# Altium project Battery_monitor.PrjPcb
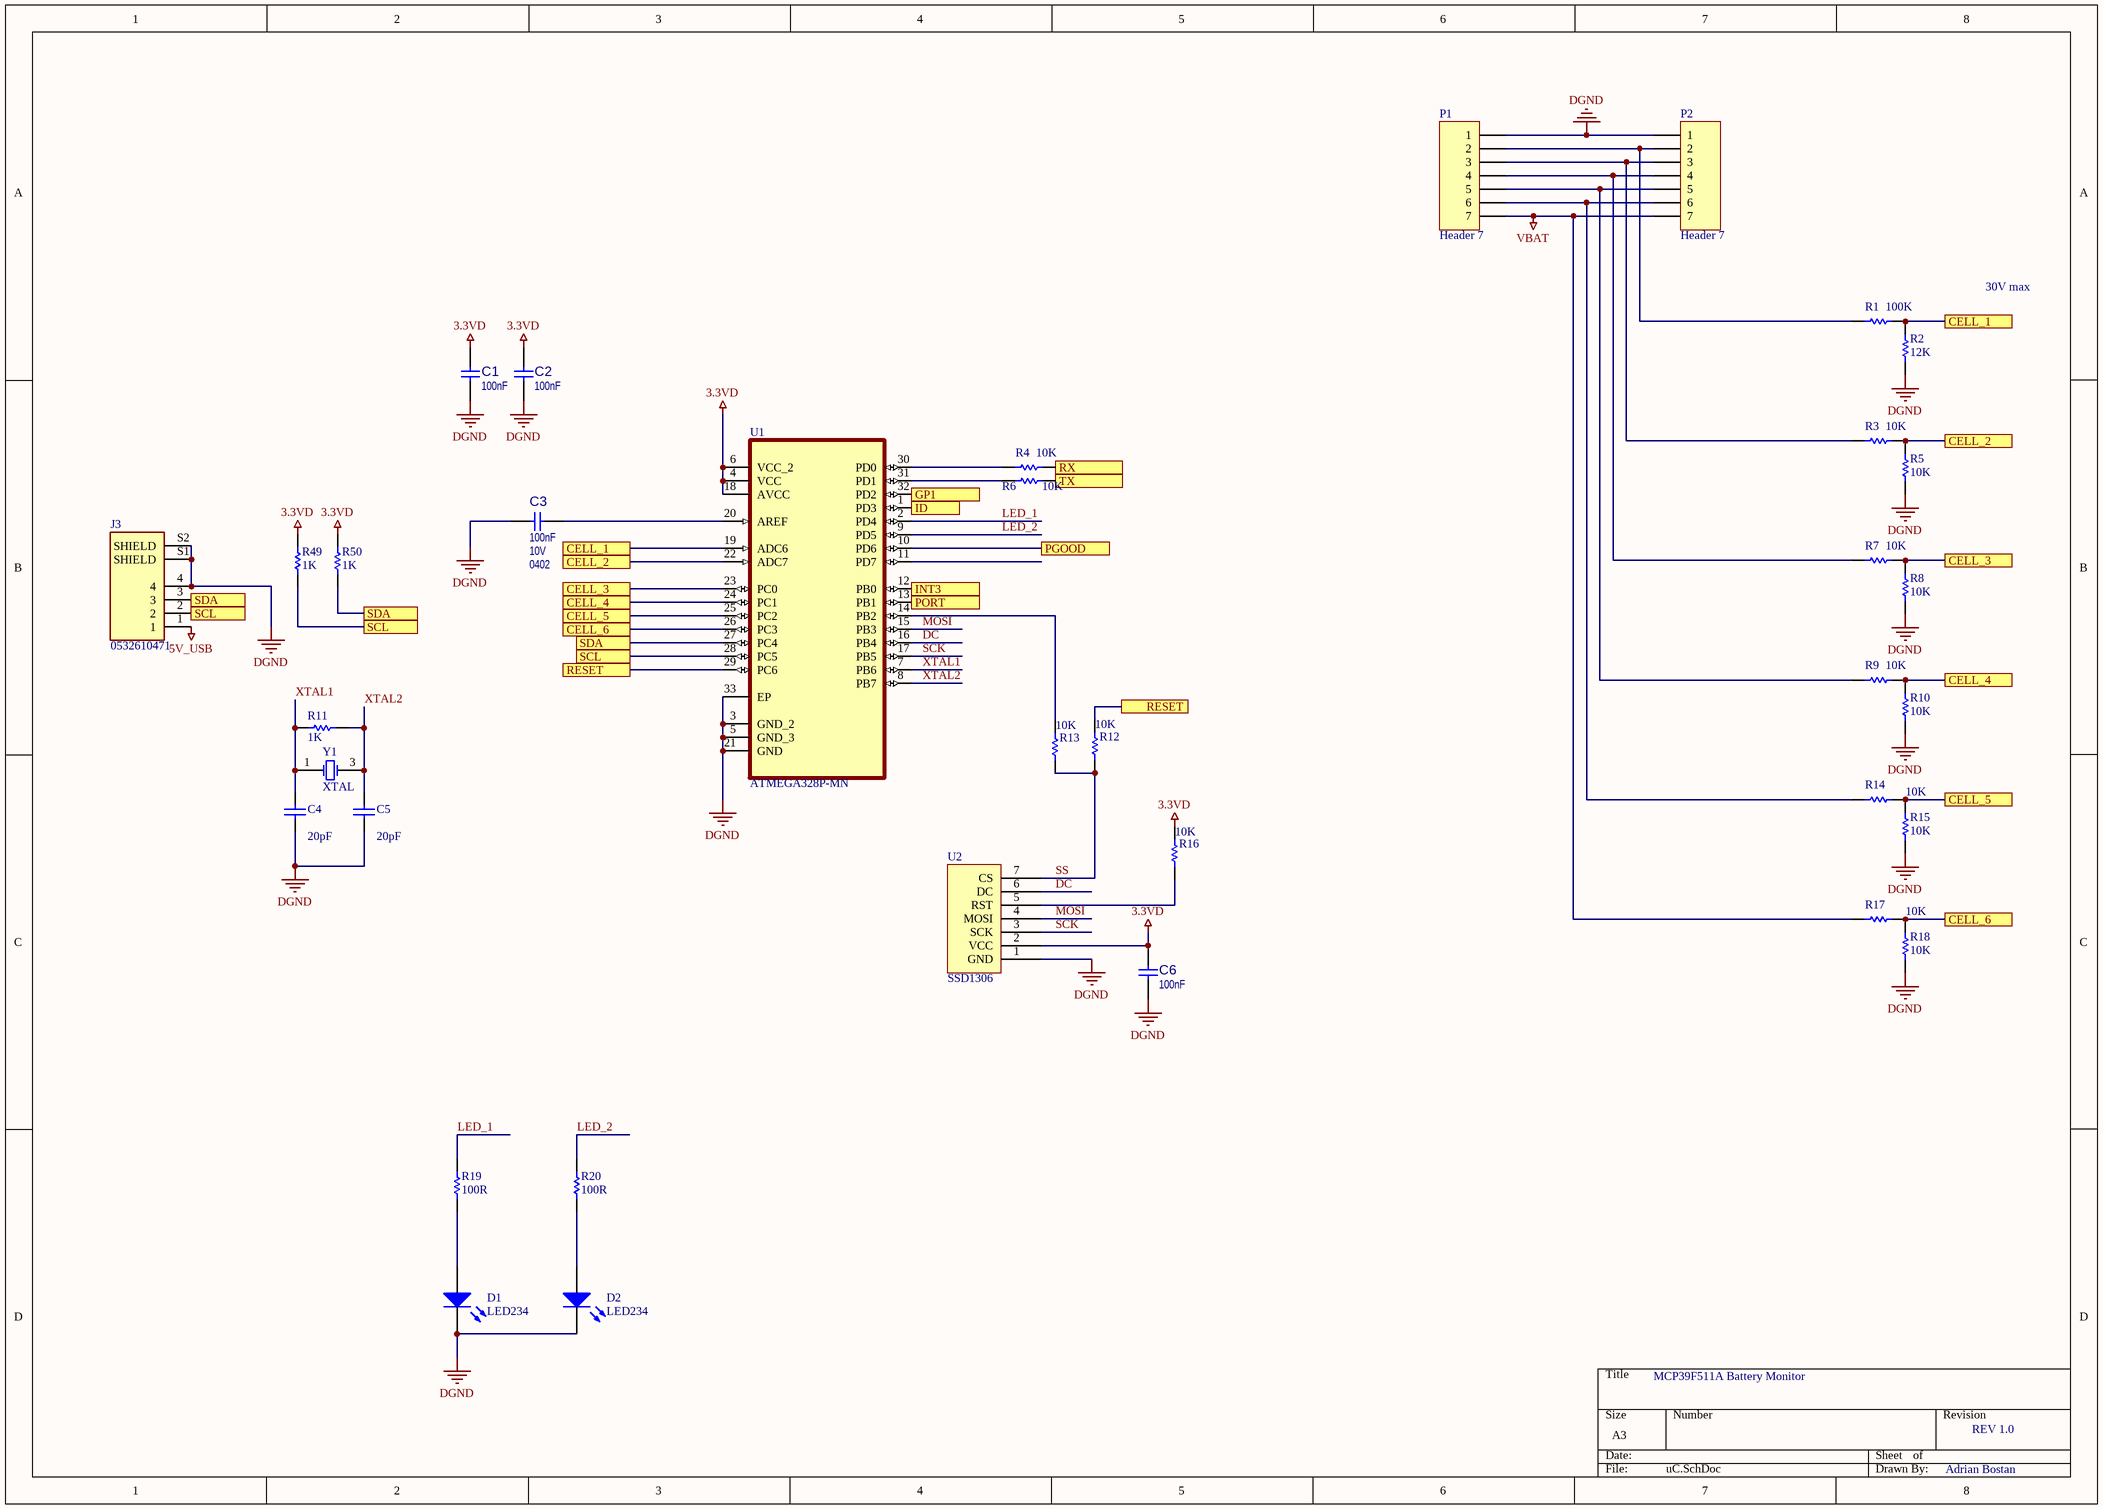
[diagram p0: uC.SchDoc]
Title: Adrian
4 sheets, 113 parts. Net scope: flat (ports and power ports of the same name join across sheets).
Board file: Batt_monitor.PcbDoc
Sheets:
  uC.SchDoc
  usb.SchDoc
  MCP39F511A.SchDoc
  Power.SchDoc

## Sheet uC.SchDoc: Adrian
size A3

### Parts
C1  value 100nF  [CAP0603M]
C2  value 100nF  [CAP0603M]
C3  value 100nF  Voltage: 10V  Package: 0402  [CAP0603M]
C4  value 20pF  [CAP0603M]  (hidden comment: Cap)
C5  value 20pF  [CAP0603M]  (hidden comment: Cap)
C6  value 100nF  [CAP0603M]
D1  LED234  [LED0603M_RED]
D2  LED234  [LED0603M_GREEN]
J3  0532610471  [0532610471]
P1  Header 7  [S7B-XH-A-1]
P2  Header 7  [S7B-XH-A-1]
R1  value 100K  [RES0603M]  (hidden comment: Res1)
R2  value 12K  [RES0603M]  (hidden comment: Res1)
R3  value 10K  [RES0603M]  (hidden comment: Res1)
R4  value 10K  [RES0603M]  (hidden comment: Res1)
R5  value 10K  [RES0603M]  (hidden comment: Res1)
R6  value 10K  [RES0603M]  (hidden comment: Res1)
R7  value 10K  [RES0603M]  (hidden comment: Res1)
R8  value 10K  [RES0603M]  (hidden comment: Res1)
R9  value 10K  [RES0603M]  (hidden comment: Res1)
R10  value 10K  [RES0603M]  (hidden comment: Res1)
R11  value 1K  [RES0603M]  (hidden comment: Res1)
R12  value 10K  [RES0603M]  (hidden comment: Res1)
R13  value 10K  [RES0603M]  (hidden comment: Res1)
R14  value 10K  [RES0603M]  (hidden comment: Res1)
R15  value 10K  [RES0603M]  (hidden comment: Res1)
R16  value 10K  [RES0603M]  (hidden comment: Res1)
R17  value 10K  [RES0603M]  (hidden comment: Res1)
R18  value 10K  [RES0603M]  (hidden comment: Res1)
R19  value 100R  [RES0603M]  (hidden comment: Res1)
R20  value 100R  [RES0603M]  (hidden comment: Res1)
R49  value 1K  [RES0603M]  (hidden comment: Res1)
R50  value 1K  [RES0603M]  (hidden comment: Res1)
U1  ATMEGA328P-MN  [QFN50P500X500X100-33N]
U2  SSD1306  [SSD1306]
Y1  XTAL  [ABM3B]

### Ports
CELL_1, CELL_2, CELL_3, CELL_4, CELL_5, CELL_6, GP1, ID, INT3, PGOOD, PORT, RESET, RX, SCL, SDA, TX

### Nets
3.3VD: C1.1 C2.1 C6.1 R16.1 R49.1 R50.1 U1.4(VCC) U1.6(VCC_2) U1.18(AVCC) U2.2(VCC)
5V_USB: J3.1
DGND: C1.2 C2.2 C3.2 C4.1 C5.1 C6.2 D1.2(K) D2.2(K) J3.4 J3.S1(SHIELD) J3.S2(SHIELD) P1.1 P2.1 R2.2 R5.2 R8.2 R10.2 R15.2 R18.2 U1.3(GND_2) U1.5(GND_3) U1.21(GND) U1.33(EP) U2.1(GND)
VBAT: P1.7 P2.7 R17.2
DC: U1.16(PB4) U2.6(DC)
LED_1: R19.2 U1.2(PD4)
LED_2: R20.2 U1.9(PD5)
MOSI: U1.15(PB3) U2.4(MOSI)
SCK: U1.17(PB5) U2.3(SCK)
SS: R12.2 R13.2 U2.7(CS)
XTAL1: C4.2 R11.2 U1.7(PB6) Y1.1(OSC1)
XTAL2: C5.2 R11.1 U1.8(PB7) Y1.3(OSC2)
NetC3_1: C3.1 U1.20(AREF)
NetD1_1: D1.1(A) R19.1
NetD2_1: D2.1(A) R20.1
NetIC1_15: U1.10(PD6) ; port PGOOD
NetJ3_2: J3.2 R49.2 U1.28(PC5) ; port SCL
NetJ3_3: J3.3 R50.2 U1.27(PC4) ; port SDA
NetP1_2: P1.2 P2.2 R1.2
NetP1_3: P1.3 P2.3 R3.2
NetP1_4: P1.4 P2.4 R7.2
NetP1_5: P1.5 P2.5 R9.2
NetP1_6: P1.6 P2.6 R14.2
NetR1_1: R1.1 R2.1 U1.19(ADC6) ; port CELL_1
NetR3_1: R3.1 R5.1 U1.22(ADC7) ; port CELL_2
NetR4_1: R4.1 ; port RX
NetR4_2: R4.2 U1.30(PD0)
NetR6_1: R6.1 ; port TX
NetR6_2: R6.2 U1.31(PD1)
NetR7_1: R7.1 R8.1 U1.23(PC0) ; port CELL_3
NetR9_1: R9.1 R10.1 U1.24(PC1) ; port CELL_4
NetR12_1: R12.1 U1.29(PC6) ; port RESET
NetR13_1: R13.1 U1.14(PB2)
NetR14_1: R14.1 R15.1 U1.25(PC2) ; port CELL_5
NetR16_2: R16.2 U2.5(RST)
NetR17_1: R17.1 R18.1 U1.26(PC3) ; port CELL_6
NetR25_1: U1.1(PD3) ; port ID
NetR26_2: U1.13(PB1) ; port PORT
NetU1_12: U1.12(PB0) ; port INT3
NetU1_32: U1.32(PD2) ; port GP1

Not connected (* = marked no-connect by the designer): U1 11(PD7)

### Notes on the sheet
- 30V max
- MCP39F511A Battery Monitor
- REV 1.0
- Adrian Bostan

### Library data of the parts
C1-C3 C6 = CAP1183: Capacitor; Manufacturer 1: Murata Electronics North America; Manufacturer Part Number 1: GRM155R61A105KE15D; Description_: CAP CER 1uF 10V 10% X5R SMD 0402; Dev Tools Status: Production; Tolerance: 10%; Temperature Coeffcient: X5R; Type: Ceramic; Owner: Aaron VanDuerm; Populated: YES; MCHP-ID: CAP1183; Revision: 0; Symbol: Capacitor NP; Status: MCL Design; ComponentLink1URL: https://chn-vm-apps.microchip.com/mchprepo/parts/Datasheets/CL05A105KP5NNNC1.pdf; ComponentLink1Description: SVN Datasheet; ComponentLink2URL: C:\ALTIUM_WORK\00001_MCHP-CDB\Datasheets\CL05A105KP5NNNC1.pdf; ComponentLink2Description: Local Datasheet; ComponentLink3URL: C:\ALTIUM_WORK\00001_MCHP-CDB\Library\LibraryRefs\Capacitor NP.SchLib; ComponentLink3Description: Open Symbol; ComponentLink4URL: C:\ALTIUM_WORK\00001_MCHP-CDB\Library\Footprints\CAP_C_0402.PcbLib; ComponentLink4Description: Open Footprint; ComponentLink5Description: Open Footprint 2; ComponentLink6Description: Open Footprint 3; ComponentLink7Description: Open Footprint 4; Operating Temperature: -55C to +85C; Category: Capacitor; Supplier 1: Digi-Key; Supplier Part Number 1: 490-3890-1-ND; Quantity Override: 1; Manufacturer 2: Samsung; Manufacturer Part Number 2: CL05A105KP5NNNC; Supplier 2: Digi-Key; Supplier Part Number 2: 1276-1076-2-ND
C4 C5 = Cap: Capacitor; Published: 8-Jun-2000; LatestRevisionDate: 17-Jul-2002; LatestRevisionNote: Re-released for DXP Platform.; PackageReference: RAD-0.3; Publisher: Altium Limited
D1 D2 = LED0: Typical INFRARED GaAs LED; Published: 8-Jun-2000; LatestRevisionDate: 08-Jul-2005; LatestRevisionNote: Mech Layer 1 removed.; PackageReference: LED-0; Publisher: Altium Limited; PackageDescription: LED; 2 Leads
J3 = 0532610471: Picoblade Connector, 4 Circuit Single Row, Right Angle Surface Mount SMT PCB; MF: Molex; MP: 0532610471; Digi-Key_Purchase_URL: https://www.digikey.com/product-detail/en/molex/0532610471/WM7622CT-ND/699109?utm_source=snapeda&utm_medium=aggregator&utm_campaign=symbol; Package: None; Digi-Key_Part_Number: WM7622CT-ND; Value: *; SnapEDA_Link: https://www.snapeda.com/parts/0532610471/Molex/view-part/542805/?ref=snap
P1 P2 = Header 7: Header, 7-Pin; LatestRevisionDate: 17-Jul-2002; LatestRevisionNote: Re-released for DXP Platform.; Publisher: Altium Limited
R1-R20 R49 R50 = Res1: Resistor; Published: 8-Jun-2000; LatestRevisionDate: 17-Jul-2002; LatestRevisionNote: Re-released for DXP Platform.; PackageReference: AXIAL-0.3; Publisher: Altium Limited; PackageDescription: Axial Device, Thru-Hole; 2 Leads; 0.3 in Pin Spacing
U1 = ATMEGA328P-MN: AVR AVRÂ® ATmega Microcontroller IC 8-Bit 20MHz 32KB _16K x 16_ FLASH 32-VQFN _5x5_; MF: Microchip; Price: None; Value: *; Package: VQFN-32 Microchip; SnapEDA_Link: https://www.snapeda.com/parts/ATMEGA328P-MN/Microchip/view-part/652121/?ref=snap; MP: ATMEGA328P-MN; Availability: Unavailable
Y1 = XTAL: Crystal Oscillator; Published: 8-Jun-2000; LatestRevisionDate: 17-Jul-2002; LatestRevisionNote: Re-released for DXP Platform.; PackageReference: R38; Publisher: Altium Limited

## Sheet usb.SchDoc: Adrian
size A3
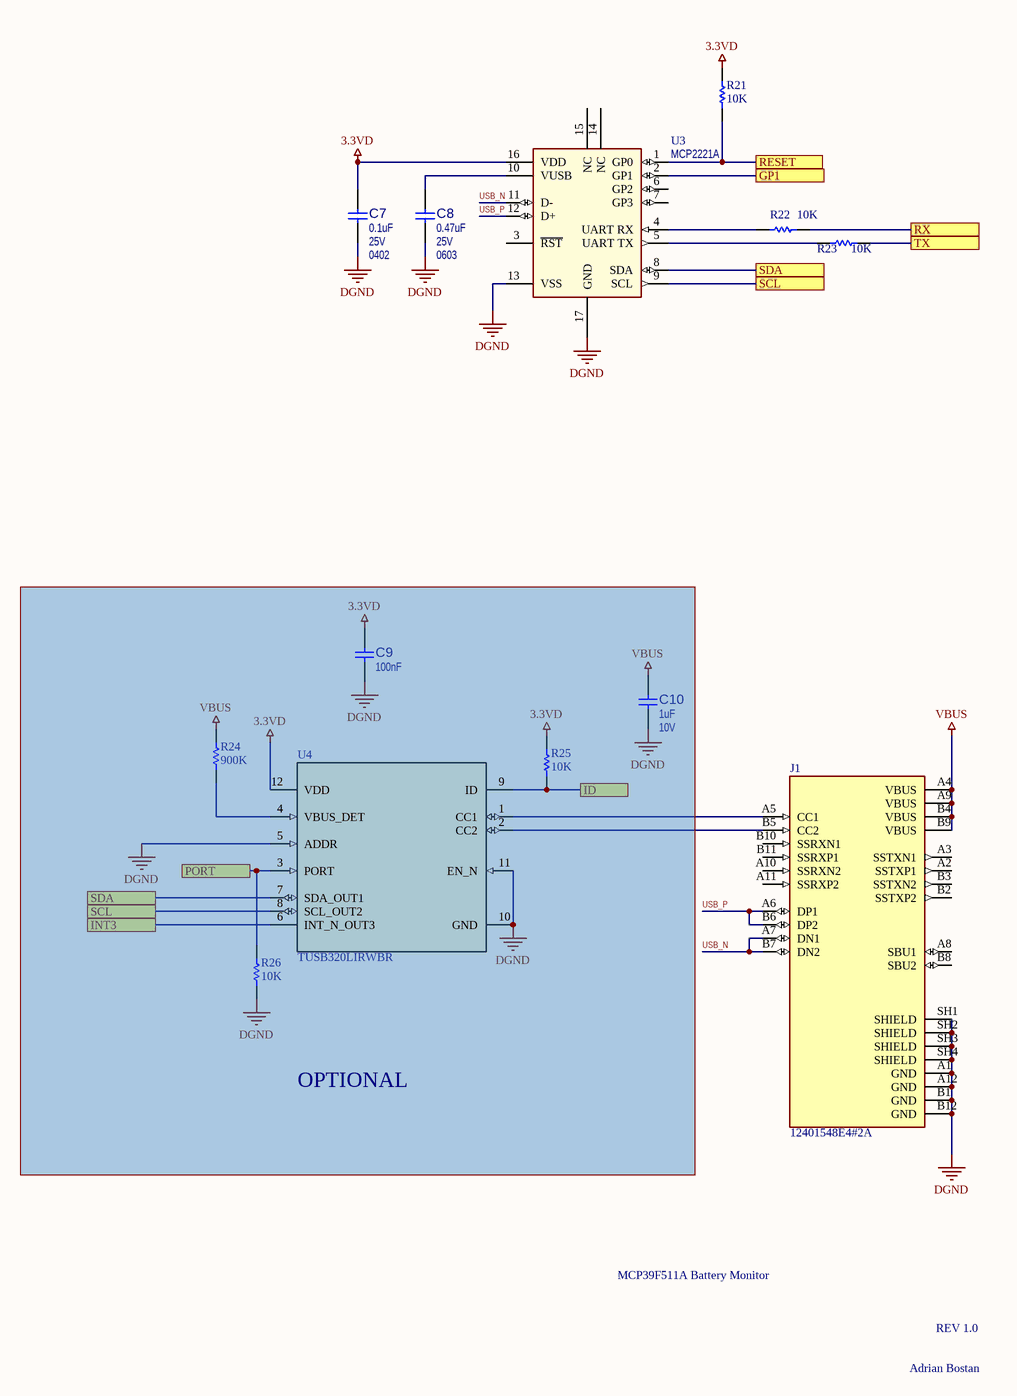
[diagram p1: usb.SchDoc]

### Parts
C7  value 0.1uF  Voltage: 25V  Package: 0402  [CAP0603M]
C8  value 0.47uF  Voltage: 25V  Package: 0603  [CAP0603M]
C9  value 100nF  [CAP0603M]
C10  value 1uF  Voltage: 10V  [CAP0603M]
J1  12401548E4#2A  [12401548E4#2A]
R21  value 10K  [RES0603M]  (hidden comment: Res1)
R22  value 10K  [RES0603M]  (hidden comment: Res1)
R23  value 10K  [RES0603M]  (hidden comment: Res1)
R24  value 900K  [RES0603M]  (hidden comment: Res1)
R25  value 10K  [RES0603M]  (hidden comment: Res1)
R26  value 10K  [RES0603M]  (hidden comment: Res1)
U3  value MCP2221A  [QFN65P400X400X95-17N]  (hidden comment: MCP2221)
U4  TUSB320LIRWBR  [12-x2qfn]

### Blocks framed on the sheet
OPTIONAL: C9 C10 R24-R26 U4

### Ports
GP1, ID, INT3, PORT, RESET, RX, SCL, SDA, TX

### Nets
3.3VD: C7.2 C9.1 R21.2 R25.2 U3.16(VDD) U4.12(VDD)
DGND: C7.1 C8.1 C9.2 C10.1 J1.A1(GND) J1.A12(GND) J1.B1(GND) J1.B12(GND) J1.SH1(SHIELD) J1.SH2(SHIELD) J1.SH3(SHIELD) J1.SH4(SHIELD) R26.1 U3.13(VSS) U3.17(GND) U4.5(ADDR) U4.10(GND) U4.11(EN_N)
VBUS: C10.2 J1.A4(VBUS) J1.A9(VBUS) J1.B4(VBUS) J1.B9(VBUS) R24.2
USB_N: J1.A7(DN1) J1.B7(DN2) U3.11(D-)
USB_P: J1.A6(DP1) J1.B6(DP2) U3.12(D+)
NetC8_2: C8.2 U3.10(VUSB)
NetJ1_A5: J1.A5(CC1) U4.1(CC1)
NetJ1_B5: J1.B5(CC2) U4.2(CC2)
NetJ3_2: U3.9(SCL) U4.8(SCL_OUT2) ; port SCL
NetJ3_3: U3.8(SDA) U4.7(SDA_OUT1) ; port SDA
NetR4_1: R22.1 ; port RX
NetR6_1: R23.1 ; port TX
NetR12_1: R21.1 U3.1(GP0) ; port RESET
NetR22_2: R22.2 U3.4(UART_RX)
NetR23_2: R23.2 U3.5(UART_TX)
NetR24_1: R24.1 U4.4(VBUS_DET)
NetR25_1: R25.1 U4.9(ID) ; port ID
NetR26_2: R26.2 U4.3(PORT) ; port PORT
NetU1_12: U4.6(INT_N_OUT3) ; port INT3
NetU1_32: U3.2(GP1) ; port GP1

Not connected (* = marked no-connect by the designer): J1 A2(SSTXP1) A3(SSTXN1) A8(SBU1) A10(SSRXN2) A11(SSRXP2) B2(SSTXP2) B3(SSTXN2) B8(SBU2) B10(SSRXN1) B11(SSRXP1); U3 3(~{RST}) 6(GP2) 7(GP3) 14(NC) 15(NC)

### Notes on the sheet
- MCP39F511A Battery Monitor
- REV 1.0
- Adrian Bostan

### Library data of the parts
C7 = CAP1345: Capacitor; Manufacturer 1: TDK Corporation; Manufacturer Part Number 1: C1005X7R1E104K050BB; Description_: CAP CER 0.1uF 25V 10% X7R SMD 0402; Dev Tools Status: Production; Tolerance: 10%; Temperature Coeffcient: X7R; Type: Ceramic; Owner: Randolph Sobrepena; Populated: YES; MCHP-ID: CAP1345; Revision: 1; Symbol: Capacitor NP; Status: MCL Design; ComponentLink1URL: https://chn-vm-apps.microchip.com/mchprepo/parts/Datasheets/mlcc_commercial_general_en; ComponentLink1Description: SVN Datasheet; ComponentLink2URL: C:\ALTIUM_WORK\00001_MCHP-CDB\Datasheets\mlcc_commercial_general_en; ComponentLink2Description: Local Datasheet; ComponentLink3URL: C:\ALTIUM_WORK\00001_MCHP-CDB\Library\LibraryRefs\Capacitor NP.SchLib; ComponentLink3Description: Open Symbol; ComponentLink4URL: C:\ALTIUM_WORK\00001_MCHP-CDB\Library\Footprints\CAP_C_0402.PcbLib; ComponentLink4Description: Open Footprint; ComponentLink5Description: Open Footprint 2; ComponentLink6Description: Open Footprint 3; ComponentLink7Description: Open Footprint 4; Operating Temperature: -55°C to 125°C; Category: Capacitor; Supplier 1: Digi-Key; Supplier Part Number 1: 445-7348-1-ND; Quantity Override: 1
C8 = CAP1224: Capacitor; Manufacturer 1: Murata; Manufacturer Part Number 1: GRM188R71E474KA12D; Description_: CAP CER 0.47uF 25V 10% X7R SMD 0603; Dev Tools Status: Production; Tolerance: 10%; Temperature Coeffcient: X7R; Type: Ceramic; Owner: Tad Ahlvers; Populated: YES; MCHP-ID: CAP1224; Revision: 0; Symbol: Capacitor NP; Status: MCL Design; ComponentLink1URL: https://chn-vm-apps.microchip.com/mchprepo/parts/Datasheets/L0005E.pdf; ComponentLink1Description: SVN Datasheet; ComponentLink2URL: C:\ALTIUM_WORK\00001_MCHP-CDB\Datasheets\L0005E.pdf; ComponentLink2Description: Local Datasheet; ComponentLink3URL: C:\ALTIUM_WORK\00001_MCHP-CDB\Library\LibraryRefs\Capacitor NP.SchLib; ComponentLink3Description: Open Symbol; ComponentLink4URL: C:\ALTIUM_WORK\00001_MCHP-CDB\Library\Footprints\CAP_C_0603.PcbLib; ComponentLink4Description: Open Footprint; ComponentLink5Description: Open Footprint 2; ComponentLink6Description: Open Footprint 3; ComponentLink7Description: Open Footprint 4; Operating Temperature: -55C to +125C; Category: Capacitor; Supplier 1: Digi-Key; Supplier Part Number 1: 490-3291-1-ND; Quantity Override: 1
C9 C10 = CAP1183: as C1 on sheet uC; MCHP-ID: CAP1183; Revision: 0; Symbol: Capacitor NP; Status: MCL Design; ComponentLink1URL: https://chn-vm-apps.microchip.com/mchprepo/parts/Datasheets/CL05A105KP5NNNC1.pdf; ComponentLink1Description: SVN Datasheet; ComponentLink2URL: C:\ALTIUM_WORK\00001_MCHP-CDB\Datasheets\CL05A105KP5NNNC1.pdf; ComponentLink2Description: Local Datasheet; ComponentLink3URL: C:\ALTIUM_WORK\00001_MCHP-CDB\Library\LibraryRefs\Capacitor NP.SchLib; ComponentLink3Description: Open Symbol; ComponentLink4URL: C:\ALTIUM_WORK\00001_MCHP-CDB\Library\Footprints\CAP_C_0402.PcbLib; ComponentLink4Description: Open Footprint; ComponentLink5Description: Open Footprint 2; ComponentLink6Description: Open Footprint 3; ComponentLink7Description: Open Footprint 4; Operating Temperature: -55C to +85C; Category: Capacitor; Supplier 1: Digi-Key; Supplier Part Number 1: 490-3890-1-ND; Quantity Override: 1; Manufacturer 2: Samsung; Manufacturer Part Number 2: CL05A105KP5NNNC; Supplier 2: Digi-Key; Supplier Part Number 2: 1276-1076-2-ND
J1 = 12401548E4#2A: USB-C _USB TYPE-C_ USB 3.1 _USB 3.1 Gen 2, Superspeed+_ Receptacle Connector 24 Position Surface Mount, Right Angle; Through Hole; MF: Amphenol ICC; SnapEDA_Link: https://www.snapeda.com/parts/12401548E4%232A/Amphenol%20FCI/view-part/2874173/?ref=snap; Price: None; Availability: Unavailable; Value: *; MP: 12401548E4#2A; Package: None
R21-R26 = Res1: Resistor; Published: 8-Jun-2000; LatestRevisionDate: 17-Jul-2002; LatestRevisionNote: Re-released for DXP Platform.; PackageReference: AXIAL-0.3; Publisher: Altium Limited; PackageDescription: Axial Device, Thru-Hole; 2 Leads; 0.3 in Pin Spacing
U3 = MCP2221: Manufacturer 1: Microchip Technology; Manufacturer Part Number 1: MCP2221A-I/ST; MCHP-ID: MIC6555; Description_: MCHP INTERFACE USB I2C UART MCP2221A-I/ST TSSOP-14; Symbol: MCP2221 SOIC-14_TSSOP-14_PDIP-14; Dev Tools Status: Production; Owner: Tim Moffat; Populated: YES; Type: USB; Status: MCL Design; Revision: 1; Category: MCHP-Interface; ComponentLink1Description: SVN Datasheet; ComponentLink2URL: C:\ALTIUM_WORK\00001_MCHP-CDB\Datasheets\20005292B.pdf; ComponentLink2Description: Local Datasheet; ComponentLink3URL: C:\ALTIUM_WORK\00001_MCHP-CDB\Library\LibraryRefs\MCP2221 SOIC-14_TSSOP-14_PDIP-14.SchLib; ComponentLink3Description: Open Symbol; ComponentLink4URL: C:\ALTIUM_WORK\00001_MCHP-CDB\Library\Footprints\TSSOP-14.PcbLib; ComponentLink4Description: Open Footprint; ComponentLink5Description: Open Footprint 2; ComponentLink6Description: Open Footprint 3; ComponentLink7Description: Open Footprint 4; Supplier 1: Microchip Technology; Supplier Part Number 1: MCP2221A-I/ST; Quantity Override: 1
U4 = TUSB320LIRWBR: Imported; Manufacturer: Texas Instruments; CompType: IC; PIN_COUNT: 12; Application_BuildNumber: *; PartNumber: TUSB320LIRWBR; PackageReference: RWB0012A; MountType: SMT; RoHS: Y; RefDes: RefDes; TYPE: TYPE; Value: Value

## Sheet MCP39F511A.SchDoc: Adrian
size A3
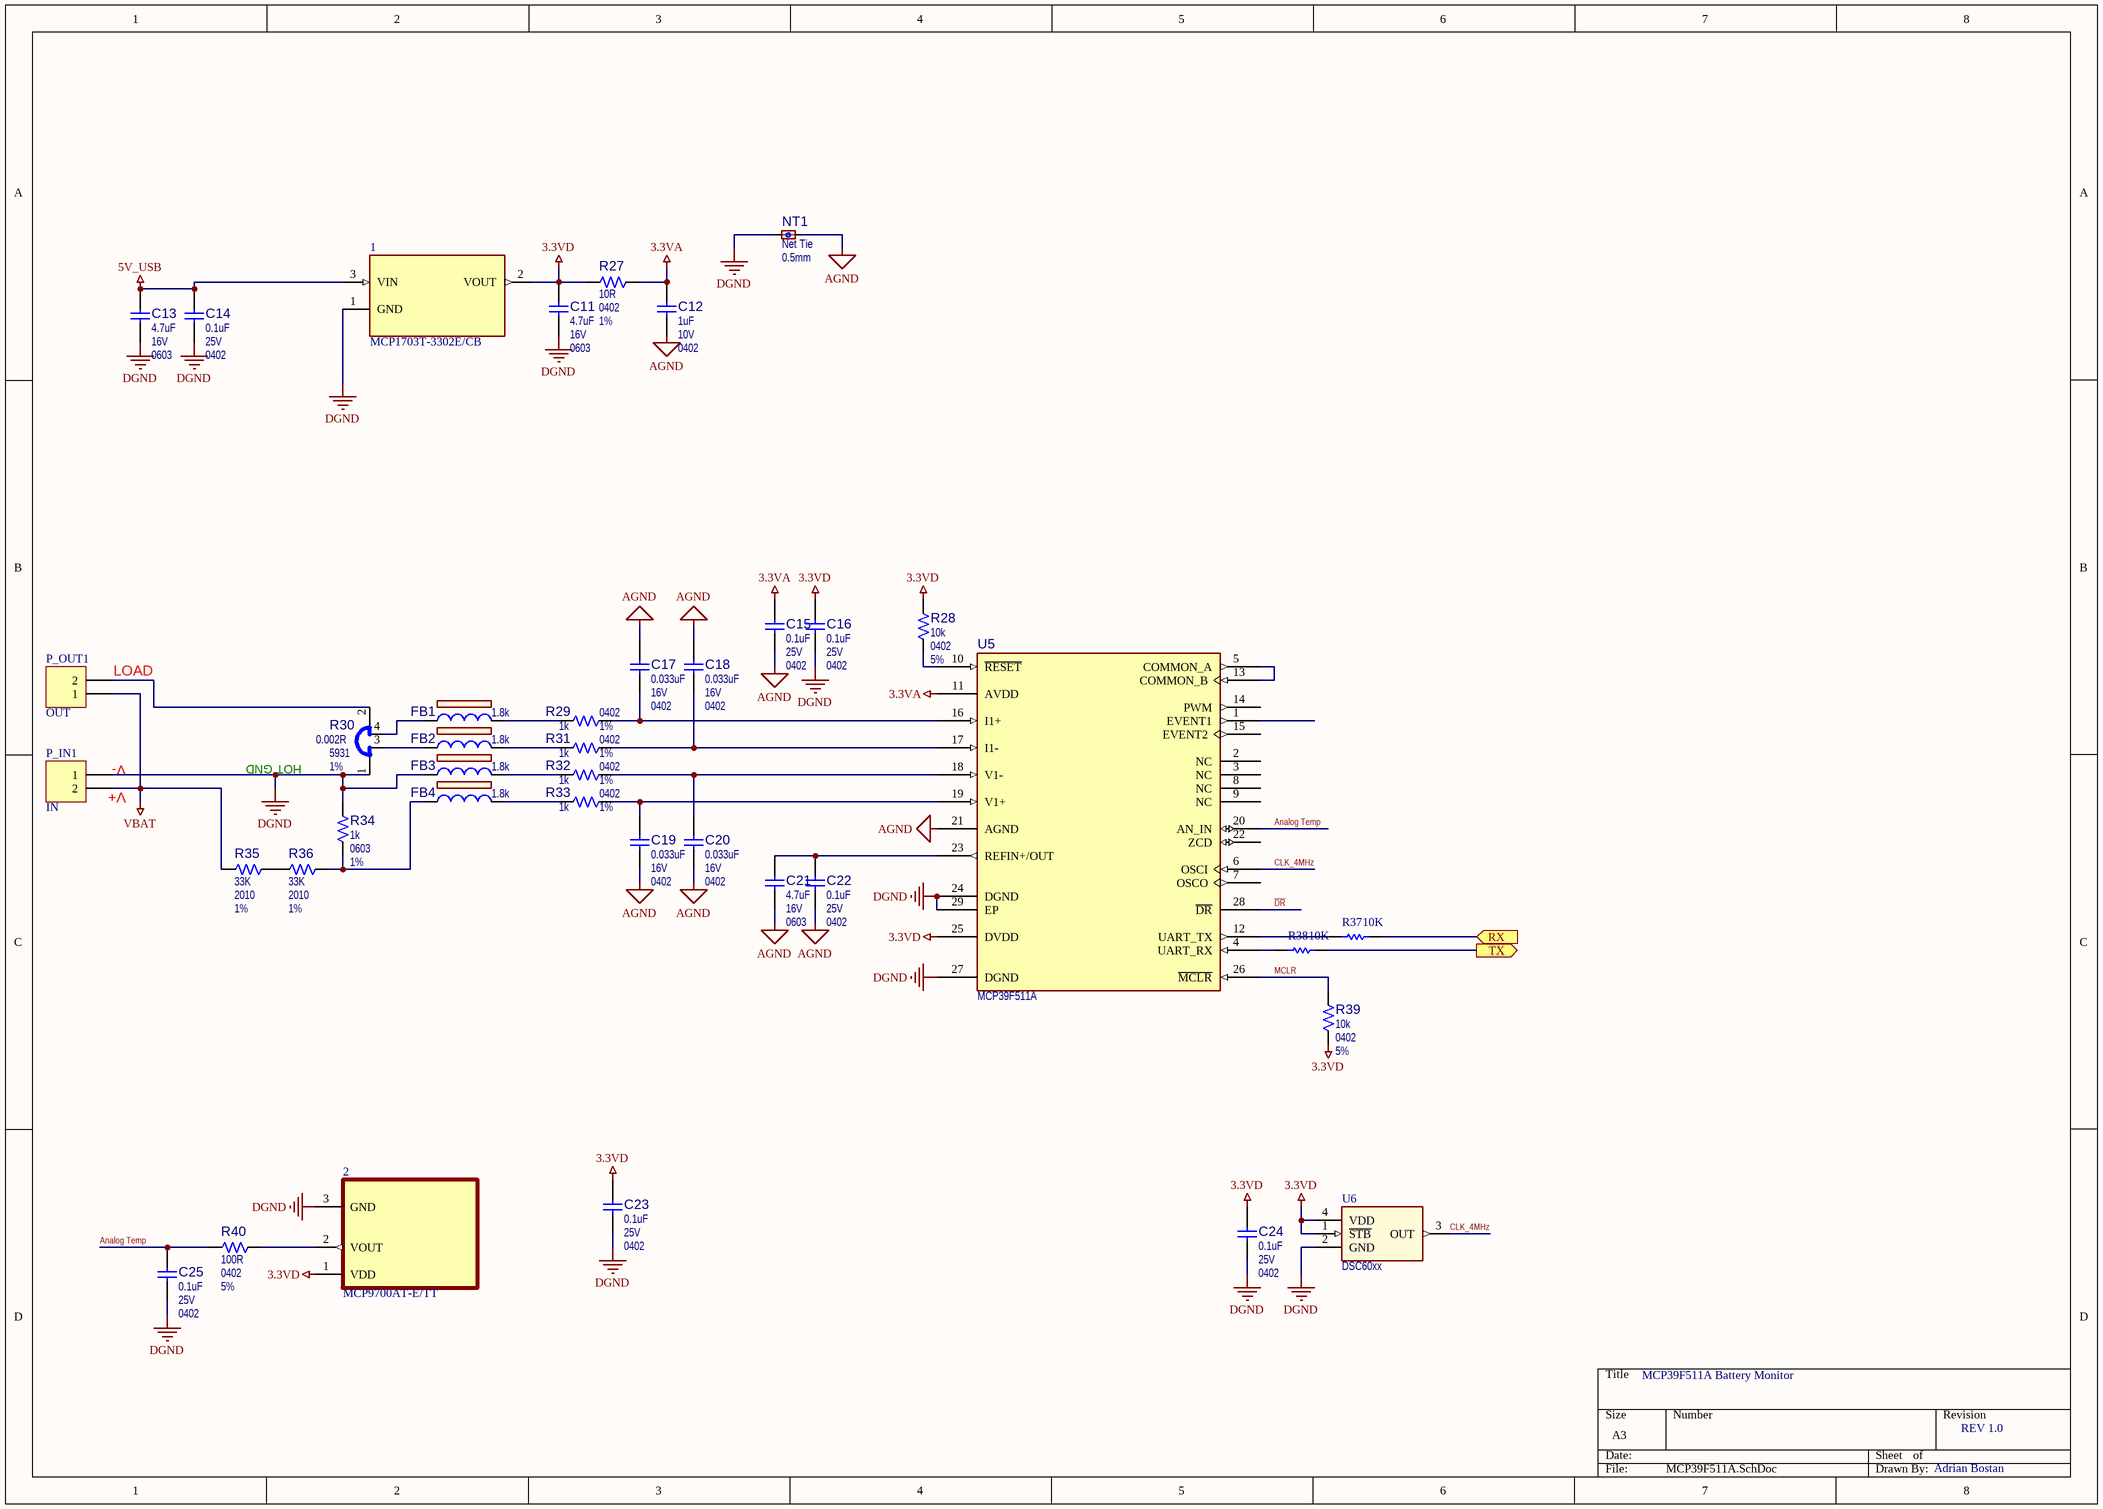
[diagram p2: MCP39F511A.SchDoc]

### Parts
1  MCP1703T-3302E/CB  [SOT95P300X145-3N]
2  MCP9700AT-E/TT  [SOT95P237X112-3N]
C11  value 4.7uF  Voltage: 16V  Package: 0603  [CAP0603M]
C12  value 1uF  Voltage: 10V  Package: 0402  [CAP0603M]
C13  value 4.7uF  Voltage: 16V  Package: 0603  [CAP0603M]
C14  value 0.1uF  Voltage: 25V  Package: 0402  [CAP0603M]
C15  value 0.1uF  Voltage: 25V  Package: 0402  [CAP0603M]
C16  value 0.1uF  Voltage: 25V  Package: 0402  [CAP0603M]
C17  value 0.033uF  Voltage: 16V  Package: 0402  [CAP0603M]
C18  value 0.033uF  Voltage: 16V  Package: 0402  [CAP0603M]
C19  value 0.033uF  Voltage: 16V  Package: 0402  [CAP0603M]
C20  value 0.033uF  Voltage: 16V  Package: 0402  [CAP0603M]
C21  value 4.7uF  Voltage: 16V  Package: 0603  [CAP0603M]
C22  value 0.1uF  Voltage: 25V  Package: 0402  [CAP0603M]
C23  value 0.1uF  Voltage: 25V  Package: 0402  [CAP0603M]
C24  value 0.1uF  Voltage: 25V  Package: 0402  [CAP0603M]
C25  value 0.1uF  Voltage: 25V  Package: 0402  [CAP0603M]
FB1  value 1.8k  [RES0603M]
FB2  value 1.8k  [RES0603M]
FB3  value 1.8k  [RES0603M]
FB4  value 1.8k  [RES0603M]
NT1  Package: 0.5mm  [NET_TIE_0.5mm]  (hidden comment: Net Tie)  (net tie, no BOM)
P_IN1  IN  [XT60PW-M]
P_OUT1  OUT  [XT60PW-F]
R27  value 10R  Package: 0402  Tolerance: 1%  [RES0603M]
R28  value 10k  Package: 0402  Tolerance: 5%  [RES0603M]  (hidden comment: Resistor)
R29  value 1k  Package: 0402  Tolerance: 1%  [RES0603M]  (hidden comment: Resistor)
R30  value 0.002R  Tolerance: 1%  [5931]  (hidden comment: Shunt 4 Pin)
R31  value 1k  Package: 0402  Tolerance: 1%  [RES0603M]  (hidden comment: Resistor)
R32  value 1k  Package: 0402  Tolerance: 1%  [RES0603M]  (hidden comment: Resistor)
R33  value 1k  Package: 0402  Tolerance: 1%  [RES0603M]  (hidden comment: Resistor)
R34  value 1k  Package: 0603  Tolerance: 1%  [RES0603M]  (hidden comment: Resistor)
R35  value 33K  Package: 2010  Tolerance: 1%  [RES2010]  (hidden comment: Resistor)
R36  value 33K  Package: 2010  Tolerance: 1%  [RES2010]  (hidden comment: Resistor)
R37  value 10K  [RES0603M]  (hidden comment: Res1)
R38  value 10K  [RES0603M]  (hidden comment: Res1)
R39  value 10k  Package: 0402  Tolerance: 5%  [RES0603M]  (hidden comment: Resistor)
R40  value 100R  Package: 0402  Tolerance: 5%  [RES0603M]  (hidden comment: Resistor)
U5  value MCP39F511A  [QFN50P500X500X100-29N]  (hidden comment: MCP39F511 QFN-28)
U6  value DSC60xx  [DSC60xx]  (hidden comment: OSCILLATOR DSC1001)

### Ports
RX (in), TX (out)

### Nets
3.3VA: C12.2 C15.2 R27.2 U5.11(AVDD)
3.3VD: 1.2(VOUT) 2.1(VDD) C11.2 C16.2 C23.2 C24.2 R27.1 R28.2 R39.1 U5.25(DVDD) U6.1(~{STB}) U6.4(VDD)
5V_USB: 1.3(VIN) C13.1 C14.2
AGND: C12.1 C15.1 C17.2 C18.2 C19.1 C20.1 C21.1 C22.1 NT1.2 U5.21(AGND)
DGND: 1.1(GND) 2.3(GND) C11.1 C13.2 C14.1 C16.1 C23.1 C24.1 C25.1 FB3.1 NT1.1 P_IN1.1 R30.1 R34.2 U5.24(DGND) U5.27(DGND) U5.29(EP) U6.2(GND)
VBAT: P_IN1.2 P_OUT1.1 R35.1
Analog Temp: C25.2 R40.1 U5.20(AN_IN)
CLK_4MHz: U5.6(OSCI) U6.3(OUT)
~{DR}: U5.28(~{DR})
MCLR: R39.2 U5.26(~{MCLR})
Net2_2: 2.2(VOUT) R40.2
NetC17_1: C17.1 R29.2 U5.16(I1+)
NetC18_1: C18.1 R31.2 U5.17(I1-)
NetC19_2: C19.2 R33.2 U5.19(V1+)
NetC20_2: C20.2 R32.2 U5.18(V1-)
NetC21_2: C21.2 C22.2 U5.23(REFIN+/OUT)
NetFB1_1: FB1.1 R30.4
NetFB1_2: FB1.2 R29.1
NetFB2_1: FB2.1 R30.3
NetFB2_2: FB2.2 R31.1
NetFB3_2: FB3.2 R32.1
NetFB4_1: FB4.1 R34.1 R36.1
NetFB4_2: FB4.2 R33.1
NetP_OUT1_2: P_OUT1.2 R30.2
NetR4_1: R37.1 ; port RX
NetR6_1: R38.1 ; port TX
NetR28_1: R28.1 U5.10(~{RESET})
NetR35_2: R35.2 R36.2
NetR37_2: R37.2 U5.12(UART_TX)
NetR38_2: R38.2 U5.4(UART_RX)
NetU5_5: U5.5(COMMON_A) U5.13(COMMON_B)

Not connected (* = marked no-connect by the designer): U5 1(EVENT1) 2(NC) 3(NC) 7(OSCO) 8(NC) 9(NC) 14(PWM) 15(EVENT2) 22(ZCD)

### Notes on the sheet
- (near P_OUT1) LOAD
- (near P_IN1) V+
- (near P_IN1) V-
- HOT GND
- MCP39F511A Battery Monitor
- REV 1.0
- Adrian Bostan

### Library data of the parts
1 = MCP1703T-3302E/CB: Linear Voltage Regulator IC 1 Output 250mA SOT-23A-3; MF: Microchip; Price: None; Availability: Unavailable; MP: MCP1703T-3302E/CB; Package: SOT-23 Microchip; SnapEDA_Link: https://www.snapeda.com/parts/MCP1703T-3302E/CB/Microchip/view-part/47542/?ref=snap; Value: *
2 = MCP9700AT-E/TT: Temperature Sensor Analog, Local -40Â°C ~ 125Â°C 10mV/Â°C SOT-23-3; MF: Microchip; Package: SOT-23-3 Microchip; MP: MCP9700AT-E/TT; Value: *; Availability: Unavailable; Price: None; SnapEDA_Link: https://www.snapeda.com/parts/MCP9700AT-E/TT/Microchip/view-part/105359/?ref=snap
C11 C21 = CAP1288: Capacitor; Manufacturer 1: TDK Corporation; Manufacturer Part Number 1: C1608X5R1C475K080AC; Description_: CAP CER 4.7uF 16V 10% X5R SMD 0603; Dev Tools Status: Production; Tolerance: 10%; Temperature Coeffcient: X5R; Type: Ceramic; Owner: Jairuz Agang-ang; Populated: YES; MCHP-ID: CAP1288; Revision: 1; Symbol: Capacitor NP; Status: MCL Design; ComponentLink1URL: https://chn-vm-apps.microchip.com/mchprepo/parts/Datasheets/mlcc_commercial_general_en.pdf; ComponentLink1Description: SVN Datasheet; ComponentLink2URL: C:\ALTIUM_WORK\00001_MCHP-CDB\Datasheets\mlcc_commercial_general_en.pdf; ComponentLink2Description: Local Datasheet; ComponentLink3URL: C:\ALTIUM_WORK\00001_MCHP-CDB\Library\LibraryRefs\Capacitor NP.SchLib; ComponentLink3Description: Open Symbol; ComponentLink4URL: C:\ALTIUM_WORK\00001_MCHP-CDB\Library\Footprints\CAP_C_0603.PcbLib; ComponentLink4Description: Open Footprint; ComponentLink5Description: Open Footprint 2; ComponentLink6Description: Open Footprint 3; ComponentLink7Description: Open Footprint 4; Operating Temperature: -55C to +85C; Category: Capacitor; Supplier 1: Digi-Key; Supplier Part Number 1: 445-7478-1-ND; Quantity Override: 1
C12 = CAP1183: as C1 on sheet uC; MCHP-ID: CAP1183; Revision: 0; Symbol: Capacitor NP; Status: MCL Design; ComponentLink1URL: https://chn-vm-apps.microchip.com/mchprepo/parts/Datasheets/CL05A105KP5NNNC1.pdf; ComponentLink1Description: SVN Datasheet; ComponentLink2URL: C:\ALTIUM_WORK\00001_MCHP-CDB\Datasheets\CL05A105KP5NNNC1.pdf; ComponentLink2Description: Local Datasheet; ComponentLink3URL: C:\ALTIUM_WORK\00001_MCHP-CDB\Library\LibraryRefs\Capacitor NP.SchLib; ComponentLink3Description: Open Symbol; ComponentLink4URL: C:\ALTIUM_WORK\00001_MCHP-CDB\Library\Footprints\CAP_C_0402.PcbLib; ComponentLink4Description: Open Footprint; ComponentLink5Description: Open Footprint 2; ComponentLink6Description: Open Footprint 3; ComponentLink7Description: Open Footprint 4; Operating Temperature: -55C to +85C; Category: Capacitor; Supplier 1: Digi-Key; Supplier Part Number 1: 490-3890-1-ND; Quantity Override: 1; Manufacturer 2: Samsung; Manufacturer Part Number 2: CL05A105KP5NNNC; Supplier 2: Digi-Key; Supplier Part Number 2: 1276-1076-2-ND
C13 = CAP1288: Capacitor; Manufacturer 1: TDK Corporation; Manufacturer Part Number 1: C1608X5R1C475K080AC; Description_: CAP CER 4.7uF 16V 10% X5R SMD 0603; Dev Tools Status: Production; Tolerance: 10%; Temperature Coeffcient: X5R; Type: Ceramic; Populated: YES; Owner: Jairuz Agang-ang; MCHP-ID: CAP1288; Revision: 1; Symbol: Capacitor NP; Status: MCL Design; ComponentLink1URL: https://chn-vm-apps.microchip.com/mchprepo/parts/Datasheets/mlcc_commercial_general_en.pdf; ComponentLink1Description: SVN Datasheet; ComponentLink2URL: C:\ALTIUM_WORK\00001_MCHP-CDB\Datasheets\mlcc_commercial_general_en.pdf; ComponentLink2Description: Local Datasheet; ComponentLink3URL: C:\ALTIUM_WORK\00001_MCHP-CDB\Library\LibraryRefs\Capacitor NP.SchLib; ComponentLink3Description: Open Symbol; ComponentLink4URL: C:\ALTIUM_WORK\00001_MCHP-CDB\Library\Footprints\CAP_C_0603.PcbLib; ComponentLink4Description: Open Footprint; ComponentLink5Description: Open Footprint 2; ComponentLink6Description: Open Footprint 3; ComponentLink7Description: Open Footprint 4; Operating Temperature: -55C to +85C; Category: Capacitor; Supplier 1: Digi-Key; Supplier Part Number 1: 445-7478-1-ND; Quantity Override: 1
C14-C16 C22-C25 = CAP1345: as C7 on sheet usb; MCHP-ID: CAP1345; Revision: 1; Symbol: Capacitor NP; Status: MCL Design; ComponentLink1URL: https://chn-vm-apps.microchip.com/mchprepo/parts/Datasheets/mlcc_commercial_general_en; ComponentLink1Description: SVN Datasheet; ComponentLink2URL: C:\ALTIUM_WORK\00001_MCHP-CDB\Datasheets\mlcc_commercial_general_en; ComponentLink2Description: Local Datasheet; ComponentLink3URL: C:\ALTIUM_WORK\00001_MCHP-CDB\Library\LibraryRefs\Capacitor NP.SchLib; ComponentLink3Description: Open Symbol; ComponentLink4URL: C:\ALTIUM_WORK\00001_MCHP-CDB\Library\Footprints\CAP_C_0402.PcbLib; ComponentLink4Description: Open Footprint; ComponentLink5Description: Open Footprint 2; ComponentLink6Description: Open Footprint 3; ComponentLink7Description: Open Footprint 4; Operating Temperature: -55°C to 125°C; Category: Capacitor; Supplier 1: Digi-Key; Supplier Part Number 1: 445-7348-1-ND; Quantity Override: 1
C17-C20 = CAP1257: Capacitor; Manufacturer 1: TDK Corporation; Manufacturer Part Number 1: CGA2B2X7R1C333K050BA; Description_: CAP CER 0.033uF 16V 10% X7R SMD 0402; Dev Tools Status: Design; Tolerance: 10%; Temperature Coeffcient: X7R; Type: Ceramic; Owner: Bogdan Popescu; Populated: YES; MCHP-ID: CAP1257; Revision: A; Symbol: Capacitor NP; Status: MCL Design; ComponentLink1URL: https://chn-vm-apps.microchip.com/mchprepo/parts/Datasheets/mlcc_automotive_general_en.pdf; ComponentLink1Description: SVN Datasheet; ComponentLink2URL: C:\ALTIUM_WORK\00001_MCHP-CDB\Datasheets\mlcc_automotive_general_en.pdf; ComponentLink2Description: Local Datasheet; ComponentLink3URL: C:\ALTIUM_WORK\00001_MCHP-CDB\Library\LibraryRefs\Capacitor NP.SchLib; ComponentLink3Description: Open Symbol; ComponentLink4URL: C:\ALTIUM_WORK\00001_MCHP-CDB\Library\Footprints\CAP_C_0402.PcbLib; ComponentLink4Description: Open Footprint; ComponentLink5Description: Open Footprint 2; ComponentLink6Description: Open Footprint 3; ComponentLink7Description: Open Footprint 4; Operating Temperature: -55C to +125C; Category: Capacitor; Supplier 1: Digi-Key; Supplier Part Number 1: 445-12238-1-ND; Quantity Override: 1
FB1-FB4 = IND1351: Manufacturer 1: Murata Electronics; Manufacturer Part Number 1: BLM15HD182SN1D; Description_: FERRITE 1.8k 200mA SMD 0402; Dev Tools Status: Design; Owner: Razvan Cristescu; Populated: YES; DCR: 2.2R; Saturation Current: 200mA; Test Frequency: 100MHz; MCHP-ID: IND1351; Revision: A; Symbol: Ferrite Bead; Status: MCL Design; ComponentLink1URL: https://chn-vm-apps.microchip.com/mchprepo/parts/Datasheets/c31e-794748.pdf; ComponentLink1Description: SVN Datasheet; ComponentLink2URL: C:\ALTIUM_WORK\00001_MCHP-CDB\Datasheets\c31e-794748.pdf; ComponentLink2Description: Local Datasheet; ComponentLink3URL: C:\ALTIUM_WORK\00001_MCHP-CDB\Library\LibraryRefs\Ferrite Bead.SchLib; ComponentLink3Description: Open Symbol; ComponentLink4URL: C:\ALTIUM_WORK\00001_MCHP-CDB\Library\LibraryRefs\IND_C_0402.PcbLib; ComponentLink4Description: Open Footprint; ComponentLink5Description: Open Footprint 2; ComponentLink6Description: Open Footprint 3; ComponentLink7Description: Open Footprint 4; Type: Ferrite Bead; Category: Inductor; Supplier 1: Mouser; Supplier Part Number 1: 81-BLM15HD182SN1D; Quantity Override: 1; Operating Temperature: -55C to +125C; Package: 0402
NT1 = RES1102: Description_: RES Net Tie SMD Net Tie 0.5mm; Dev Tools Status: Production; Owner: Bogdan P (M91398); Populated: Yes; MCHP-ID: RES1102; Value: Net Tie; Revision: 0; Symbol: Net Tie; Status: MCL Design; ComponentLink1Description: SVN Datasheet; ComponentLink2Description: Local Datasheet; ComponentLink3URL: C:\ALTIUM_WORK\00001_MCHP-CDB\Library\LibraryRefs\Net Tie.SchLib; ComponentLink3Description: Open Symbol; ComponentLink4URL: C:\ALTIUM_WORK\00001_MCHP-CDB\Library\Footprints\NET_TIE_0.5mm.PcbLib; ComponentLink4Description: Open Footprint; ComponentLink5Description: Open Footprint 2; ComponentLink6Description: Open Footprint 3; ComponentLink7Description: Open Footprint 4; Category: Resistor; Type: RES SMD; Quantity Override: 1
P_IN1 P_OUT1 = Header 2: Header, 2-Pin; LatestRevisionDate: 17-Jul-2002; LatestRevisionNote: Re-released for DXP Platform.; Publisher: Altium Limited
R27 = RES1305: Resistor; Manufacturer 1: ROHM; Manufacturer Part Number 1: MCR01MRTF10R0; Description_: RES TKF 10R 1% 1/16W SMD 0402; Dev Tools Status: Production; Voltage: 50V; Temperature Coeffcient: 100ppm/C; Power: 1/16W; Owner: Tad Ahlvers; Populated: YES; MCHP-ID: RES1305; Revision: 1; Symbol: Resistor; Status: MCL Design; ComponentLink1URL: https://chn-vm-apps.microchip.com/mchprepo/parts/Datasheets/mcr_g.pdf; ComponentLink1Description: SVN Datasheet; ComponentLink2URL: C:\ALTIUM_WORK\00001_MCHP-CDB\Datasheets\mcr_g.pdf; ComponentLink2Description: Local Datasheet; ComponentLink3URL: C:\ALTIUM_WORK\00001_MCHP-CDB\Library\LibraryRefs\Resistor.SchLib; ComponentLink3Description: Open Symbol; ComponentLink4URL: C:\ALTIUM_WORK\00001_MCHP-CDB\Library\Footprints\RES_C_0402.PcbLib; ComponentLink4Description: Open Footprint; ComponentLink5Description: Open Footprint 2; ComponentLink6Description: Open Footprint 3; ComponentLink7Description: Open Footprint 4; Operating Temperature: -55C to +155C; Category: Resistor; Type: RES SMD; Composition: TKF; Supplier 1: Digi-Key; Supplier Part Number 1: RHM10.0CDTR-ND; Quantity Override: 1
R28 R39 = RSMT0439: Manufacturer 1: Vishay; Manufacturer Part Number 1: CRCW040210K0JNED; Description_: RES TKF 10k 5% 1/16W SMD 0402; Dev Tools Status: Production; Voltage: 50V; Temperature Coeffcient: 100ppm/C; Power: 1/16W; Populated: Yes; MCHP-ID: RSMT0439; Revision: 1; Symbol: Resistor; Status: MCL Design; ComponentLink1URL: https://chn-vm-apps.microchip.com/mchprepo/parts/Datasheets/PYu-RC0402_51_RoHS_L_6.pdf; ComponentLink1Description: SVN Datasheet; ComponentLink2URL: C:\ALTIUM_WORK\00001_MCHP-CDB\Datasheets\PYu-RC0402_51_RoHS_L_6.pdf; ComponentLink2Description: Local Datasheet; ComponentLink3URL: C:\ALTIUM_WORK\00001_MCHP-CDB\Library\LibraryRefs\Resistor.SchLib; ComponentLink3Description: Open Symbol; ComponentLink4URL: C:\ALTIUM_WORK\00001_MCHP-CDB\Library\Footprints\RES_C_0402.PcbLib; ComponentLink4Description: Open Footprint; ComponentLink5Description: Open Footprint 2; ComponentLink6Description: Open Footprint 3; ComponentLink7Description: Open Footprint 4; Operating Temperature: -55C to +155C; Category: Resistor; Type: RES SMD; Composition: TKF; Manufacturer 2: Yageo; Manufacturer Part Number 2: RC0402JR-0710KL; Supplier 1: Digi-Key; Supplier Part Number 1: 541-10KJCT-ND; Supplier 2: Digi-Key; Supplier Part Number 2: 311-10KJRCT-ND; Quantity Override: 1
R29 R31-R33 = RES1022: Manufacturer 1: Panasonic; Manufacturer Part Number 1: ERJ-2RKF1001X; Description_: RES TKF 1k 1% 1/10W SMD 0402; Dev Tools Status: Production; Voltage: 50V; Temperature Coeffcient: 100ppm/C; Power: 1/10W; Owner: Tad Ahlvers; Populated: YES; MCHP-ID: RES1022; Revision: 2; Symbol: Resistor; Status: MCL Design; ComponentLink1URL: https://chn-vm-apps.microchip.com/mchprepo/parts/Datasheets/AOA0000CE2.pdf; ComponentLink1Description: SVN Datasheet; ComponentLink2URL: C:\ALTIUM_WORK\00001_MCHP-CDB\Datasheets\AOA0000CE2.pdf; ComponentLink2Description: Local Datasheet; ComponentLink3URL: C:\ALTIUM_WORK\00001_MCHP-CDB\Library\LibraryRefs\Resistor.SchLib; ComponentLink3Description: Open Symbol; ComponentLink4URL: C:\ALTIUM_WORK\00001_MCHP-CDB\Library\Footprints\RES_C_0402.PcbLib; ComponentLink4Description: Open Footprint; ComponentLink5Description: Open Footprint 2; ComponentLink6Description: Open Footprint 3; ComponentLink7Description: Open Footprint 4; Operating Temperature: -55C to +155C; Category: Resistor; Type: RES SMD; Composition: TKF; Supplier 1: Digi-Key; Supplier Part Number 1: P1.00KLTR-ND; Quantity Override: 1
R30 = RES1247: Shunt; Manufacturer 1: Stackpole Electronics Inc; Manufacturer Part Number 1: CSNL2512FT2L00; Description_: RES SHUNT MF 0.002R 1% 2W 2512; Dev Tools Status: Production; Voltage: 200V; Temperature Coeffcient: 50ppm/C; Power: 2W; Owner: Bogdan P (M91398); Populated: Yes; MCHP-ID: RES1247; Package: 5931; Revision: 0; Symbol: Shunt 4 Pin; Status: MCL Design; ComponentLink1URL: https://chn-vm-apps.microchip.com/mchprepo/parts/Datasheets/SEI-CSNL.pdf; ComponentLink1Description: SVN Datasheet; ComponentLink2URL: C:\ALTIUM_WORK\00001_MCHP-CDB\Datasheets\SEI-CSNL.pdf; ComponentLink2Description: Local Datasheet; ComponentLink3URL: C:\ALTIUM_WORK\00001_MCHP-CDB\Library\LibraryRefs\Shunt 4 Pin.SchLib; ComponentLink3Description: Open Symbol; ComponentLink4URL: C:\ALTIUM_WORK\00001_MCHP-CDB\Library\Footprints\RES_C_2512_SHUNT.PcbLib; ComponentLink4Description: Open Footprint; ComponentLink5Description: Open Footprint 2; ComponentLink6Description: Open Footprint 3; ComponentLink7Description: Open Footprint 4; Operating Temperature: -55C to +170C; Category: Resistor; Type: Shunt; Composition: MF; Supplier 1: Digi-Key; Supplier Part Number 1: LRMAP5930C-R002FT; Quantity Override: 1
R34 = RSMT0138: Manufacturer 1: Panasonic; Manufacturer Part Number 1: ERJ-3EKF1001V; Description_: RES TKF 1k 1% 1/10W SMD 0603; Dev Tools Status: Production; Voltage: 75V; Temperature Coeffcient: 100ppm/C; Power: 1/10W; Populated: Yes; MCHP-ID: RSMT0138; Revision: 2; Symbol: Resistor; Status: MCL Design; ComponentLink1URL: https://chn-vm-apps.microchip.com/mchprepo/parts/Datasheets/AOA0000CE2.pdf; ComponentLink1Description: SVN Datasheet; ComponentLink2URL: C:\ALTIUM_WORK\00001_MCHP-CDB\Datasheets\AOA0000CE2.pdf; ComponentLink2Description: Local Datasheet; ComponentLink3URL: C:\ALTIUM_WORK\00001_MCHP-CDB\Library\LibraryRefs\Resistor.SchLib; ComponentLink3Description: Open Symbol; ComponentLink4URL: C:\ALTIUM_WORK\00001_MCHP-CDB\Library\Footprints\RES_C_0603.PcbLib; ComponentLink4Description: Open Footprint; ComponentLink5Description: Open Footprint 2; ComponentLink6Description: Open Footprint 3; ComponentLink7Description: Open Footprint 4; Operating Temperature: -55C to +155C; Category: Resistor; Type: RES SMD; Composition: TKF; Manufacturer 2: Yageo; Manufacturer Part Number 2: RC0603FR-071KL; Manufacturer 3: ROHM; Manufacturer Part Number 3: MCR03EZPFX1001; Manufacturer 4: Stackpole Electronics Inc; Manufacturer Part Number 4: RMCF0603FT1K00; Manufacturer 5: Stackpole Electronics Inc; Manufacturer Part Number 5: RMCF 1/16 1K 1% R; Manufacturer 6: Vishay; Manufacturer Part Number 6: CRCW06031K00FKEA; Manufacturer 7: Stackpole Electronics Inc; Manufacturer Part Number 7: RMCF1/161.0K1%TR; Manufacturer 8: TE Connectivity; Manufacturer Part Number 8: 1622866-1; Supplier 1: Digi-Key; Supplier Part Number 1: P1.00KHCT-ND; Supplier 2: Digi-Key; Supplier Part Number 2: P1.00KHTR-ND; Supplier 3: Digi-Key; Supplier Part Number 3: 311-1.00KHRCT-ND; Supplier 4: Digi-Key; Supplier Part Number 4: RHM1.00KHCT-ND; Supplier 5: Digi-Key; Supplier Part Number 5: RMCF1/161KFRTR-ND; Supplier 6: Digi-Key; Supplier Part Number 6: RMCF0603FT1K00TR-ND; Supplier 7: Newark; Supplier Part Number 7: 52K8015; Supplier 8: Stackpole Electronics Inc; Supplier Part Number 8: RMCF1/161.0K1%TR; Supplier 9: Digi-Key; Supplier Part Number 9: A106049CT-ND; Quantity Override: 1
R35 R36 = RSMT1084: Manufacturer 1: Vishay Dale; Manufacturer Part Number 1: CRCW2010499KFKEF; Description_: RES TKF 499k 1% 3/4W SMD 2010; Dev Tools Status: Production; Voltage: 400V; Temperature Coeffcient: 100ppm/C; Power: 3/4W; Owner: Bogdan Popescu; Populated: YES; MCHP-ID: RSMT1084; Revision: 1; Symbol: Resistor; Status: MCL Design; ComponentLink1URL: https://chn-vm-apps.microchip.com/mchprepo/parts/Datasheets/dcrcwe3.pdf; ComponentLink1Description: SVN Datasheet; ComponentLink2URL: C:\ALTIUM_WORK\00001_MCHP-CDB\Datasheets\dcrcwe3.pdf; ComponentLink2Description: Local Datasheet; ComponentLink3URL: C:\ALTIUM_WORK\00001_MCHP-CDB\Library\LibraryRefs\Resistor.SchLib; ComponentLink3Description: Open Symbol; ComponentLink4URL: C:\ALTIUM_WORK\00001_MCHP-CDB\Library\Footprints\RES_C_2010.PcbLib; ComponentLink4Description: Open Footprint; ComponentLink5Description: Open Footprint 2; ComponentLink6Description: Open Footprint 3; ComponentLink7Description: Open Footprint 4; Category: Resistor; Type: RES SMD; Composition: TKF; Supplier 1: Digi-Key; Supplier Part Number 1: 541-499KACCT-ND; Quantity Override: 1
R37 R38 = Res1: Resistor; Published: 8-Jun-2000; LatestRevisionDate: 17-Jul-2002; LatestRevisionNote: Re-released for DXP Platform.; PackageReference: AXIAL-0.3; Publisher: Altium Limited; PackageDescription: Axial Device, Thru-Hole; 2 Leads; 0.3 in Pin Spacing
R40 = RSMT1038: Manufacturer 1: Yageo; Manufacturer Part Number 1: RC0402JR-07100RL; Description_: RES TKF 100R 5% 1/16W SMD 0402; Dev Tools Status: Production; Voltage: 50V; Temperature Coeffcient: 100ppm/C; Power: 1/16W; Owner: Sompoch Loboonlert; Populated: Yes; MCHP-ID: RSMT1038; Revision: 2; Symbol: Resistor; Status: MCL Design; ComponentLink1URL: https://chn-vm-apps.microchip.com/mchprepo/parts/Datasheets/PYu-RC0402_51_RoHS_L_6.pdf; ComponentLink1Description: SVN Datasheet; ComponentLink2URL: C:\ALTIUM_WORK\00001_MCHP-CDB\Datasheets\PYu-RC0402_51_RoHS_L_6.pdf; ComponentLink2Description: Local Datasheet; ComponentLink3URL: C:\ALTIUM_WORK\00001_MCHP-CDB\Library\LibraryRefs\Resistor.SchLib; ComponentLink3Description: Open Symbol; ComponentLink4URL: C:\ALTIUM_WORK\00001_MCHP-CDB\Library\Footprints\RES_C_0402.PcbLib; ComponentLink4Description: Open Footprint; ComponentLink5Description: Open Footprint 2; ComponentLink6Description: Open Footprint 3; ComponentLink7Description: Open Footprint 4; Operating Temperature: -55C to +155C; Category: Resistor; Type: RES SMD; Composition: TKF; Supplier 1: Digi-Key; Supplier Part Number 1: 311-100JRCT-ND; Quantity Override: 1
U5 = MIC6226: ADC; Manufacturer 1: Microchip Technology; Manufacturer Part Number 1: MCP39F511-E/MQ; Description_: MCHP ANALOG ENERGY MEASUREMENT 4000:1 MCP39F511-E/MQ QFN-28; MAPS Description: Single-Phase, Power-Monitoring IC with Calculation and Event Detection; Dev Tools Status: Production; Owner: Bogdan Popescu; MPC: 360234P7X031; LeadContent: Pb-FREE; PackingMedia: TUBE; Stage: REL; LeadCount: 28; PackageWidth: 5x5x0.9mm; ForceMinOrderQtyMult: False; MinOrderQty: 0; TempRange: -40C to +125C; SeriInterface: UART; tblDeviceFamilyID: 5874; singleOR3phase: Single; ADCResBit: 24; ADCAccuracy: 94.5; AntiTemper: No; PhaseCorrctn: Yes; noOfPGAs: 2; PGARange: 1:32; MeasurementErr: 0.1%; DynamicRange: 4000:1; VoltageRefDrift: 10; SupplyVoltMin: 2.7; SupplyVoltMax: 3.6; MCHP-ID: MIC6226; Symbol: MCP39F511 QFN-28; Type: Energy Measurement; Status: MCL Design; Revision: 1; Category: MCHP-Analog; ComponentLink1URL: http://www.microchip.com/wwwproducts/Devices.aspx?product=MCP39F511; ComponentLink1Description: SVN Datasheet; ComponentLink2Description: Local Datasheet; ComponentLink3URL: C:\ALTIUM_WORK\00001_MCHP-CDB\Library\LibraryRefs\MCP39F511 QFN-28.SchLib; ComponentLink3Description: Open Symbol; ComponentLink4URL: C:\ALTIUM_WORK\00001_MCHP-CDB\Library\Footprints\QFN-28_5x5.PcbLib; ComponentLink4Description: Open Footprint; ComponentLink5Description: Open Footprint 2; ComponentLink6Description: Open Footprint 3; ComponentLink7Description: Open Footprint 4; Supplier 1: Microchip Technology; Supplier Part Number 1: MCP39F511-E/MQ; IntroductionDate: 2015-03-19; PackageType: QFN; ActivePwrCalc: Yes; VoltageRefTol: 2; DigPwrVoltMin: 2.7; DigPwrVoltMax: 3.6; IDDDigMax: 0; IDDAnaMax: 0; Populated: YES; Quantity Override: 1
U6 = OSC1131: Manufacturer 1: Microchip Technology Inc; Manufacturer Part Number 1: DSC6011JI1A-008.0000; Description_: MEMS Oscillator DSC60XX 8MHz SMD L2W2.5H.89; Dev Tools Status: Design; Owner: Tim Moffat; Populated: YES; MCHP-ID: OSC1131; Revision: B; Symbol: OSCILLATOR DSC1001; Status: MCL Design; ComponentLink1URL: https://chn-vm-apps.microchip.com/mchprepo/parts/Datasheets/20005625A.pdf; ComponentLink1Description: SVN Datasheet; ComponentLink2URL: C:\ALTIUM_WORK\00001_MCHP-CDB\Datasheets\20005625A.pdf; ComponentLink2Description: Local Datasheet; ComponentLink3URL: C:\ALTIUM_WORK\00001_MCHP-CDB\Library\LibraryRefs\OSCILLATOR DSC1001.SchLib; ComponentLink3Description: Open Symbol; ComponentLink4URL: C:\ALTIUM_WORK\00001_MCHP-CDB\Library\Footprints\OSCILLATOR_DSC60000L2.5W2.0H0.89.PcbLib; ComponentLink4Description: Open Footprint; ComponentLink5Description: Open Footprint 2; ComponentLink6Description: Open Footprint 3; ComponentLink7Description: Open Footprint 4; Operating Temperature: –40C to +85C; Package: LGA; Type: Oscillator; Category: Crystal/Oscillator; Supplier 1: Microchip Technology Inc; Supplier Part Number 1: DSC6011JI1A-008.0000; Quantity Override: 1

## Sheet Power.SchDoc: Adrian
size A3
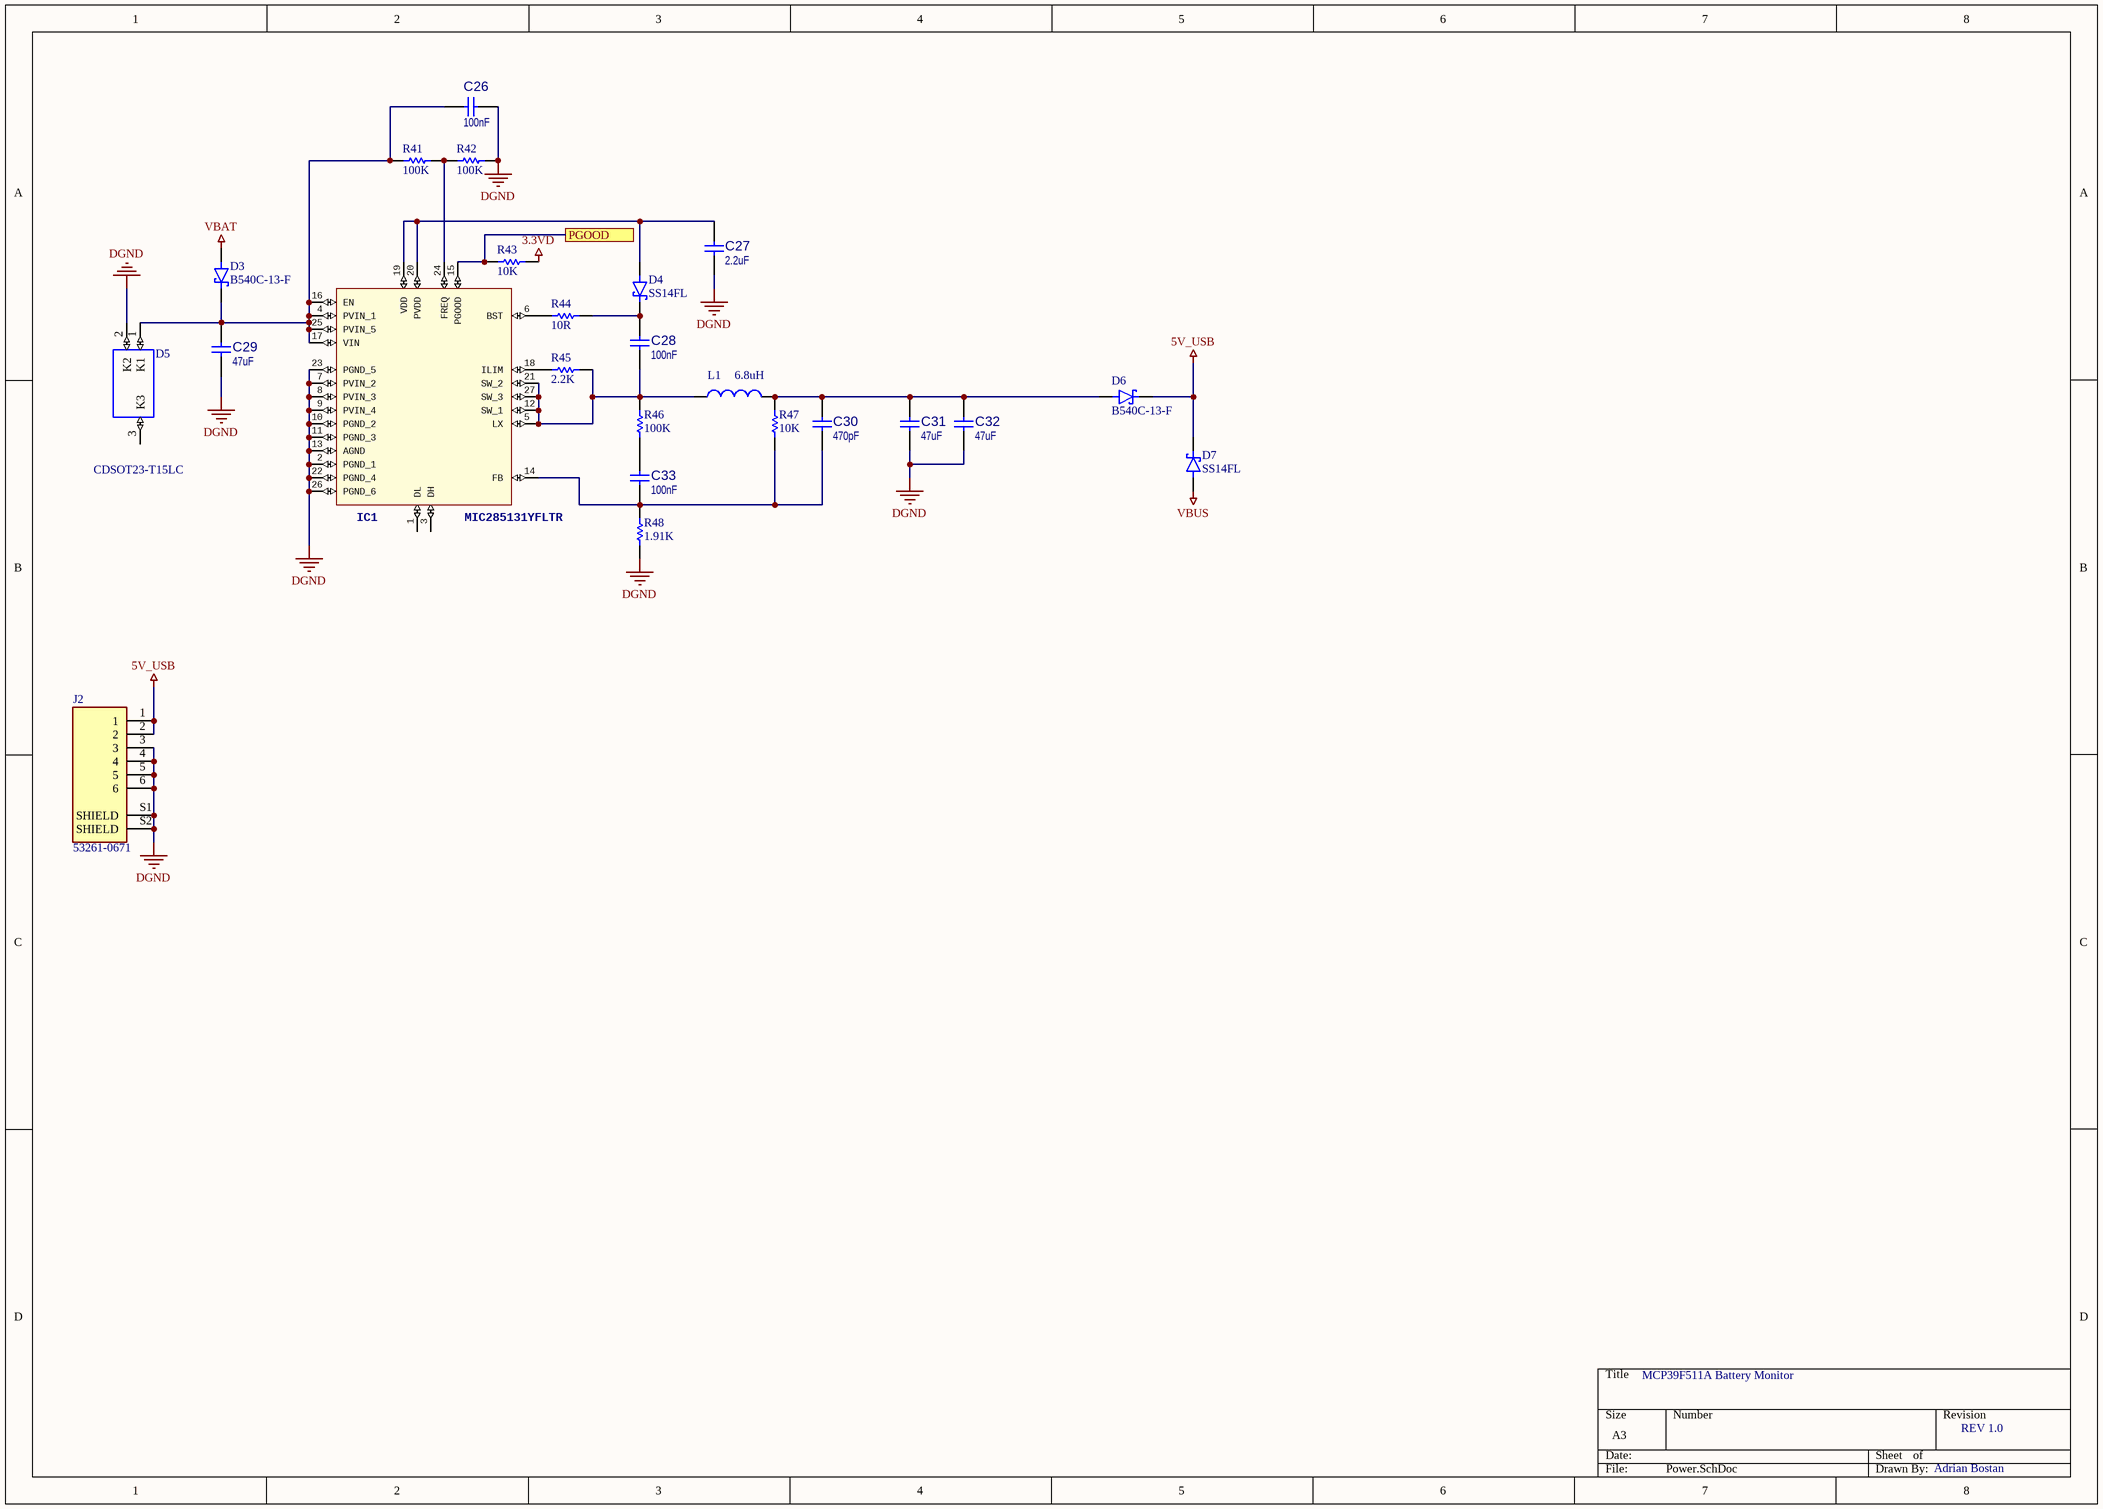
[diagram p3: Power.SchDoc]

### Parts
C26  value 100nF  [CAP0603M]
C27  value 2.2uF  [CAP0603M]
C28  value 100nF  [CAP0603M]
C29  value 47uF  [Tantal D]
C30  value 470pF  [CAP0603M]
C31  value 47uF  [Tantal D]
C32  value 47uF  [Tantal D]
C33  value 100nF  [CAP0603M]
D3  B540C-13-F  [B540C-13-F]
D4  SS14FL  [SODFL3617X108N]
D5  CDSOT23-T15LC  [SOT95P230X117-3N]
D6  B540C-13-F  [B540C-13-F]
D7  SS14FL  [SODFL3617X108N]
IC1  MIC285131YFLTR  [MIC285131YFLTR]
J2  53261-0671  [53261-0671]
L1  value 6.8uH  [SRR1050A-6R8Y]  (hidden comment: SRR1050A-6R8Y)
R41  value 100K  [RES0603M]  (hidden comment: Res1)
R42  value 100K  [RES0603M]  (hidden comment: Res1)
R43  value 10K  [RES0603M]  (hidden comment: Res1)
R44  value 10R  [RES0603M]  (hidden comment: Res1)
R45  value 2.2K  [RES0603M]  (hidden comment: Res1)
R46  value 100K  [RES0603M]  (hidden comment: Res1)
R47  value 10K  [RES0603M]  (hidden comment: Res1)
R48  value 1.91K  [RES0603M]  (hidden comment: Res1)

### Ports
PGOOD

### Nets
3.3VD: R43.1
5V_USB: D6.C(K) D7.C(K) J2.1 J2.2
DGND: C26.1 C27.1 C29.1 C31.1 C32.1 D5.2(K2) IC1.2(PGND_1) IC1.7(PVIN_2) IC1.8(PVIN_3) IC1.9(PVIN_4) IC1.10(PGND_2) IC1.11(PGND_3) IC1.13(AGND) IC1.22(PGND_4) IC1.23(PGND_5) IC1.26(PGND_6) J2.3 J2.4 J2.5 J2.6 J2.S1(SHIELD) J2.S2(SHIELD) R42.1 R48.2
VBAT: D3.A
VBUS: D7.A
NetC26_2: C26.2 C29.2 D3.C(K) D5.1(K1) IC1.4(PVIN_1) IC1.16(EN) IC1.17(VIN) IC1.25(PVIN_5) R41.2
NetC27_2: C27.2 D4.A IC1.19(VDD) IC1.20(PVDD)
NetC28_1: C28.1 IC1.5(LX) IC1.12(SW_1) IC1.21(SW_2) IC1.27(SW_3) L1.1 R45.1 R46.1
NetC28_2: C28.2 D4.C(K) R44.1
NetC30_1: C30.1 C33.1 IC1.14(FB) R47.2 R48.1
NetC30_2: C30.2 C31.2 C32.2 D6.A L1.2 R47.1
NetC33_2: C33.2 R46.2
NetIC1_6: IC1.6(BST) R44.2
NetIC1_15: IC1.15(PGOOD) R43.2 ; port PGOOD
NetIC1_18: IC1.18(ILIM) R45.2
NetIC1_24: IC1.24(FREQ) R41.1 R42.2

Not connected (* = marked no-connect by the designer): D5 3(K3); IC1 1(DL) 3(DH)

### Notes on the sheet
- MCP39F511A Battery Monitor
- REV 1.0
- Adrian Bostan

### Library data of the parts
C26-C33 = CAP1183: as C1 on sheet uC; MCHP-ID: CAP1183; Revision: 0; Symbol: Capacitor NP; Status: MCL Design; ComponentLink1URL: https://chn-vm-apps.microchip.com/mchprepo/parts/Datasheets/CL05A105KP5NNNC1.pdf; ComponentLink1Description: SVN Datasheet; ComponentLink2URL: C:\ALTIUM_WORK\00001_MCHP-CDB\Datasheets\CL05A105KP5NNNC1.pdf; ComponentLink2Description: Local Datasheet; ComponentLink3URL: C:\ALTIUM_WORK\00001_MCHP-CDB\Library\LibraryRefs\Capacitor NP.SchLib; ComponentLink3Description: Open Symbol; ComponentLink4URL: C:\ALTIUM_WORK\00001_MCHP-CDB\Library\Footprints\CAP_C_0402.PcbLib; ComponentLink4Description: Open Footprint; ComponentLink5Description: Open Footprint 2; ComponentLink6Description: Open Footprint 3; ComponentLink7Description: Open Footprint 4; Operating Temperature: -55C to +85C; Category: Capacitor; Supplier 1: Digi-Key; Supplier Part Number 1: 490-3890-1-ND; Quantity Override: 1; Manufacturer 2: Samsung; Manufacturer Part Number 2: CL05A105KP5NNNC; Supplier 2: Digi-Key; Supplier Part Number 2: 1276-1076-2-ND
D3 D6 = B540C-13-F: Diode Schottky 40V 5A Surface Mount SMC; MF: Multicomp; MP: B540C-13-F; SnapEDA_Link: https://www.snapeda.com/parts/B540C-13-F/Multicomp/view-part/588851/?ref=snap; Value: *; Package: DO-214 Multicomp; Price: None; Availability: Unavailable
D4 D7 = SS14FL: Diode Schottky 40V 1A Surface Mount SOD-123F; MF: ON Semiconductor; Value: *; Digi-Key_Part_Number: SS14FLCT-ND; Package: SOD-123F ON Semiconductor; Digi-Key_Purchase_URL: https://www.digikey.com/product-detail/en/on-semiconductor/SS14FL/SS14FLCT-ND/5305092?utm_source=snapeda&utm_medium=aggregator&utm_campaign=symbol; SnapEDA_Link: https://www.snapeda.com/parts/SS14FL/ON%20Semiconductor/view-part/2651388/?ref=snap; MP: SS14FL
D5 = CDSOT23-T24CAN: 40V Clamp 8A _8/20Âµs_ Ipp Tvs Diode Surface Mount SOT-23; MF: Bourns; Package: SOT-23-3 Bourns; MP: CDSOT23-T24CAN; SnapEDA_Link: https://www.snapeda.com/parts/CDSOT23-T24CAN/Bourns/view-part/501962/?ref=snap; Price: None; Value: *; Availability: Unavailable
IC1 = MIC28513-1YFL-TR: Manufacturer_Name: Microchip; Manufacturer_Part_Number: MIC28513-1YFL-TR; Mouser_Part_Number: 998-MIC28513-1YFLTR; Mouser_Price-Stock: https://www.mouser.com/Search/Refine.aspx?Keyword=998-MIC28513-1YFLTR; Height: 0.95mm
J2 = 53261-0671: Picoblade Connector, 6 Circuit Single Row, Right Angle Surface Mount SMT PCB; MP: 0532610671; MF: Molex; SnapEDA_Link: https://www.snapeda.com/parts/0532610671/Molex/view-part/523089/?ref=snap; Package: None; Value: *; Digi-Key_Part_Number: WM7624CT-ND; Digi-Key_Purchase_URL: https://www.digikey.com/product-detail/en/molex/0532610671/WM7624CT-ND/699111?utm_source=snapeda&utm_medium=aggregator&utm_campaign=symbol
L1 = Inductor: Code_IEC: 1005; Published: 8-Jun-2000; LatestRevisionDate: 29-May-2009; LatestRevisionNote: IPC-7351 Footprint Added.; PackageReference: 0402-A; Publisher: Altium Limited; PackageDescription: Chip Inductor; Code_JEITA: 0402
R41-R48 = Res1: Resistor; Published: 8-Jun-2000; LatestRevisionDate: 17-Jul-2002; LatestRevisionNote: Re-released for DXP Platform.; PackageReference: AXIAL-0.3; Publisher: Altium Limited; PackageDescription: Axial Device, Thru-Hole; 2 Leads; 0.3 in Pin Spacing

## Nets that join several sheets
3.3VD: uC (10 pins), usb (6 pins), MCP39F511A (12 pins), Power (R43.1)
5V_USB: uC (J3.1), MCP39F511A (1.3 C13.1 C14.2), Power (D6.C D7.C J2.1 J2.2)
DGND: uC (24 pins), usb (18 pins), MCP39F511A (18 pins), Power (24 pins)
VBAT: uC (P1.7 P2.7 R17.2), MCP39F511A (P_IN1.2 P_OUT1.1 R35.1), Power (D3.A)
VBUS: usb (6 pins), Power (D7.A)
NetIC1_15: uC (U1.10), Power (IC1.15 R43.2)
NetJ3_2: uC (J3.2 R49.2 U1.28), usb (U3.9 U4.8)
NetJ3_3: uC (J3.3 R50.2 U1.27), usb (U3.8 U4.7)
NetR4_1: uC (R4.1), usb (R22.1), MCP39F511A (R37.1)
NetR6_1: uC (R6.1), usb (R23.1), MCP39F511A (R38.1)
NetR12_1: uC (R12.1 U1.29), usb (R21.1 U3.1)
NetR25_1: uC (U1.1), usb (R25.1 U4.9)
NetR26_2: uC (U1.13), usb (R26.2 U4.3)
NetU1_12: uC (U1.12), usb (U4.6)
NetU1_32: uC (U1.32), usb (U3.2)